# EAGLE schematic numishnik (EAGLE 6.1)
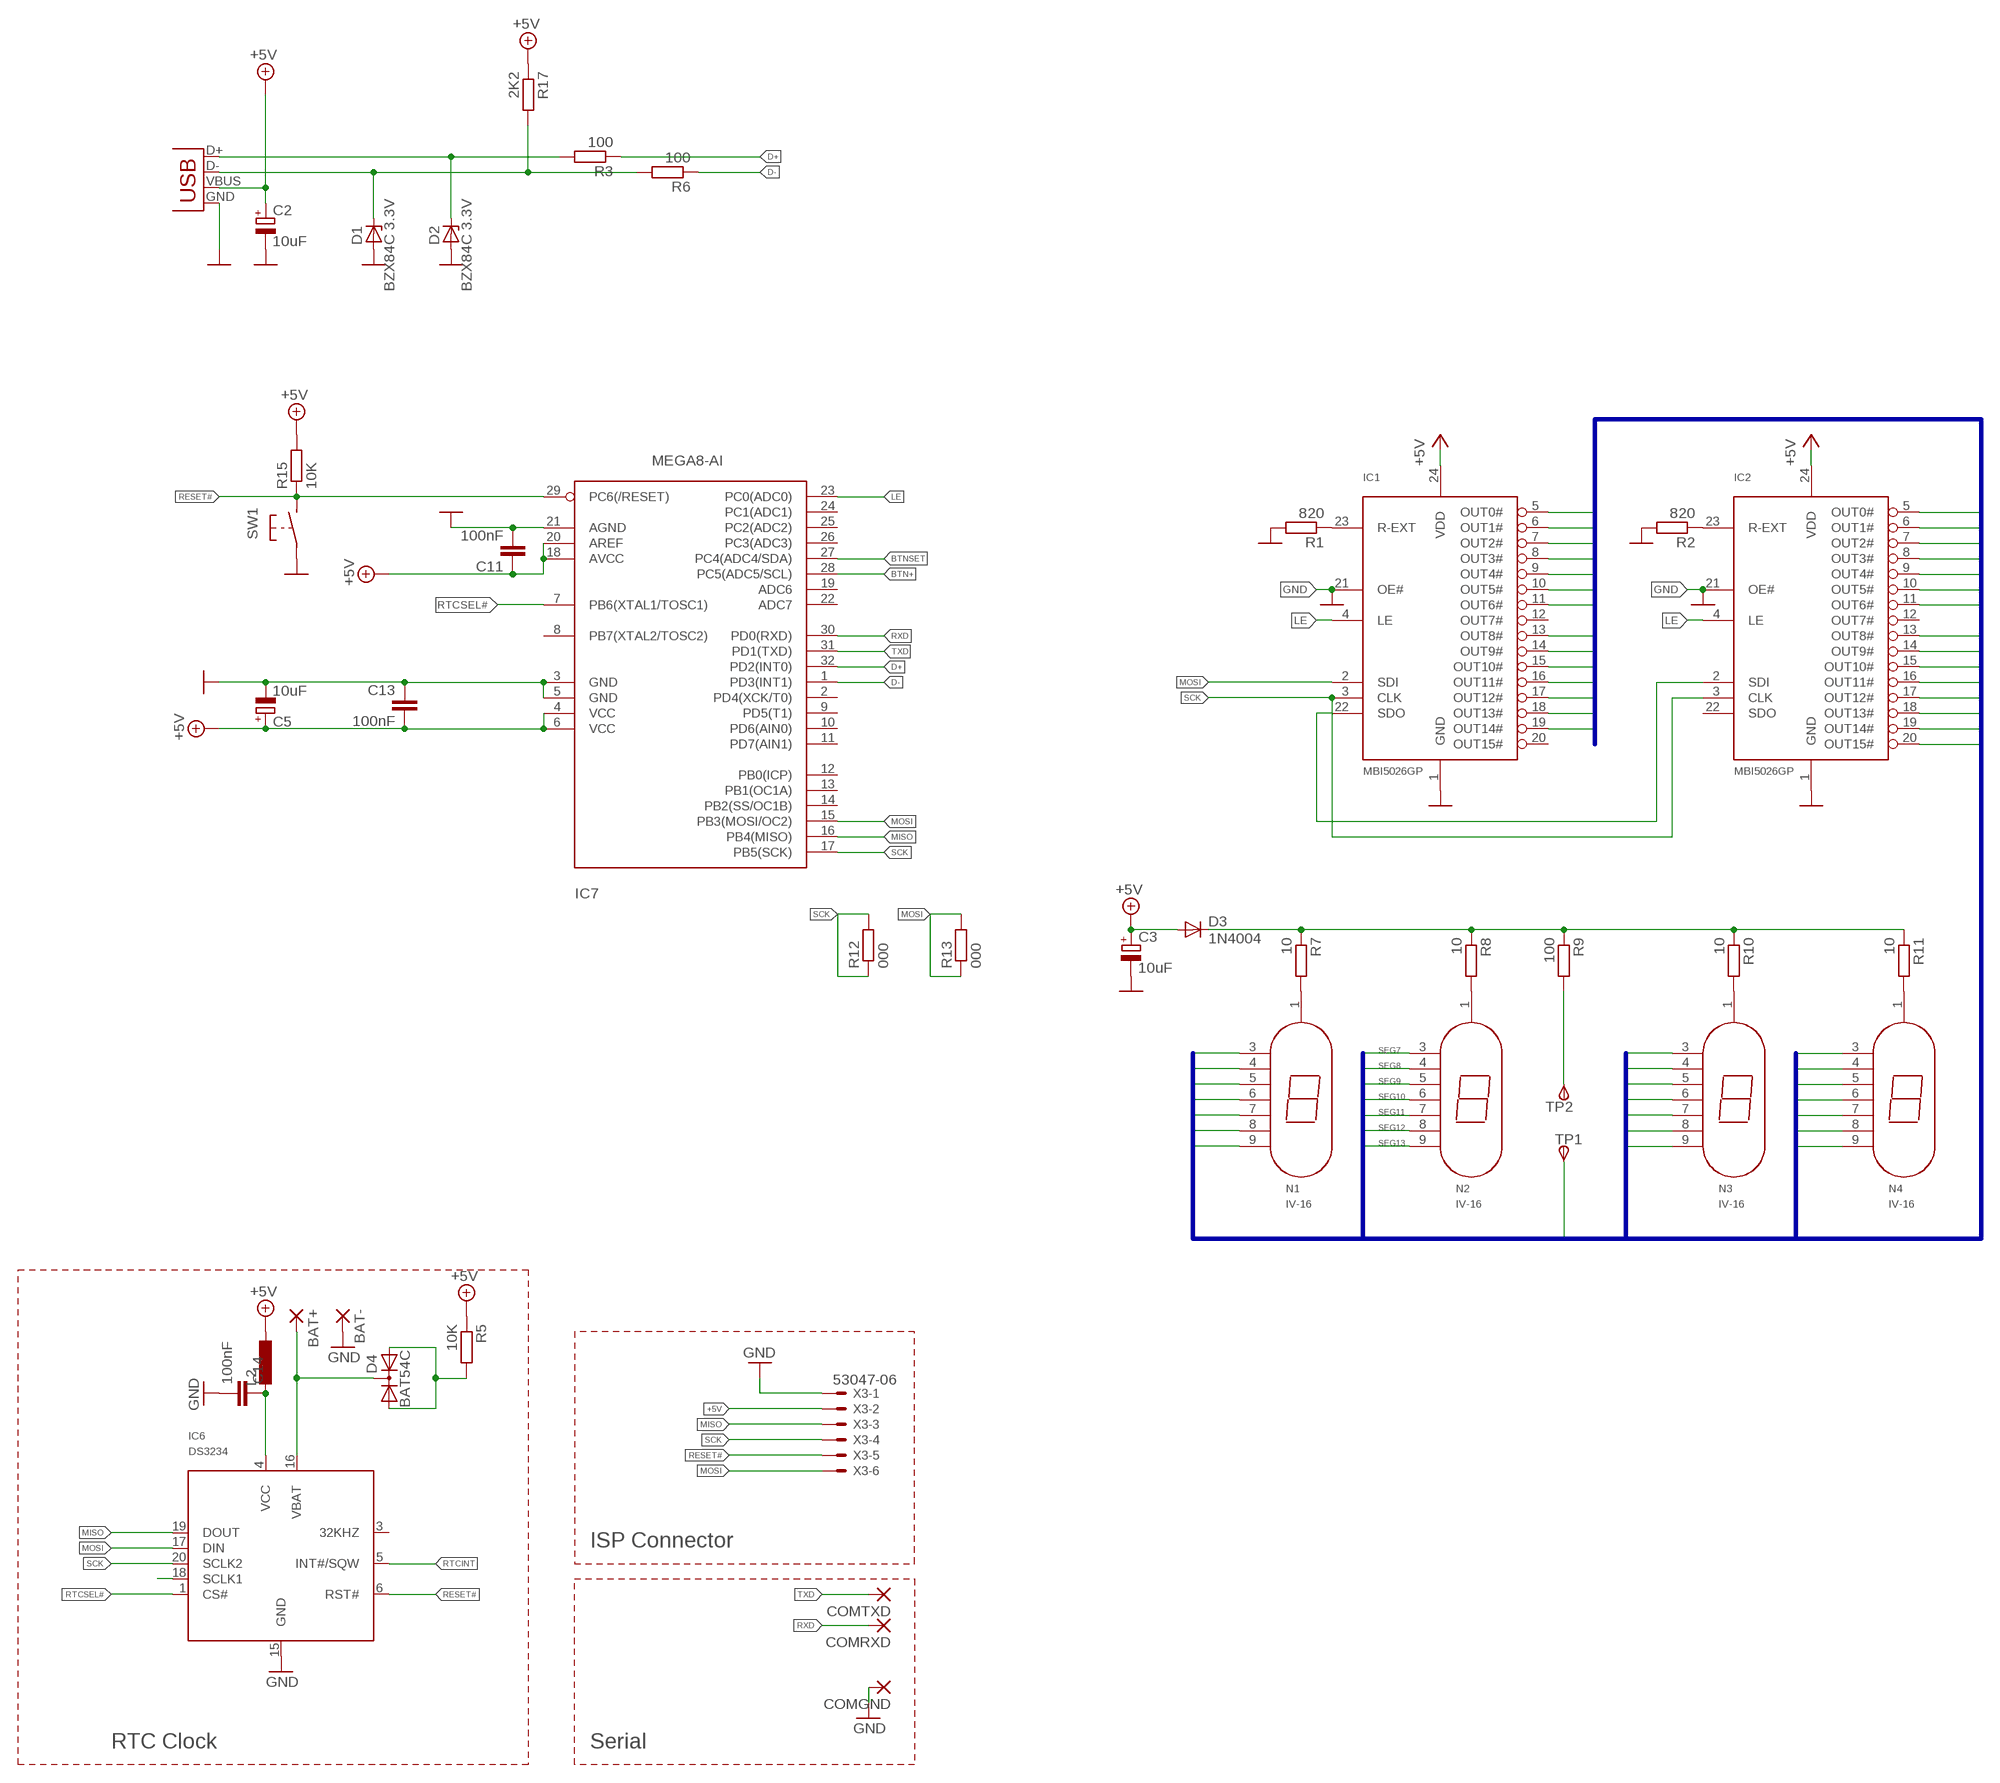
[diagram p0: schematic, sheet 1]

## Parts
BAT+  1,6/0,8  [1,6/0,8]
BAT-  1,6/0,8  [1,6/0,8]
C2  10uF  CPOL-EUSMCB  [SMC_B]
C3  10uF  CPOL-EUSMCB  [SMC_B]
C5  10uF  CPOL-EUSMCB  [SMC_B]
C11  100nF  C-EUC0603K  [C0603K]
C13  100nF  C-EUC0603K  [C0603K]
C14  100nF  C-EUC0603K  [C0603K]
COMGND  1,6/0,8  [1,6/0,8]
COMRXD  1,6/0,8  [1,6/0,8]
COMTXD  1,6/0,8  [1,6/0,8]
D1  BZX84C 3.3V  BZX84CSMD  [TO236]
D2  BZX84C 3.3V  BZX84CSMD  [TO236]
D3  1N4004  [DO41-10]
D4  BAT54C  DIODE-2AC|CASOT23  [SOT23]
IC1  MBI5026GP  [SSOP24-150]
IC2  MBI5026GP  [SSOP24-150]
IC6  DS3234  [SO-20DW]
IC7  MEGA8-AI  [TQFP32-08]
L2  L-EUL3230M  [L3230M]
N1  IV-16  [IV-16]
N2  IV-16  [IV-16]
N3  IV-16  [IV-16]
N4  IV-16  [IV-16]
R1  820  R-EU_R0805S  [R0805-SVO]
R2  820  R-EU_R0805S  [R0805-SVO]
R3  100  R-EU_R0805S  [R0805-SVO]
R5  10K  R-EU_R0805S  [R0805-SVO]
R6  100  R-EU_R0805S  [R0805-SVO]
R7  10  R-EU_R0805S  [R0805-SVO]
R8  10  R-EU_R0805S  [R0805-SVO]
R9  100  R-EU_R0805S  [R0805-SVO]
R10  10  R-EU_R0805S  [R0805-SVO]
R11  10  R-EU_R0805S  [R0805-SVO]
R12  000  R-EU_R0805S  [R0805-SVO]
R13  000  R-EU_R0805S  [R0805-SVO]
R15  10K  R-EU_R0805S  [R0805-SVO]
R17  2K2  R-EU_R0805S  [R0805-SVO]
SW1  BUTTON-IT_1181  [SW_IT1181]
TP1  TPSPAD1-13  [P1-13]
TP2  TPSPAD1-13  [P1-13]
X1  USB-MICROB  [USB-MICROB]
X3  53047-06  [53047-06]

## Nets
+5V: C2.+ C3.+ C5.+ C11.1 C13.2 D3.A IC1.24(VDD) IC2.24(VDD) IC7.4(VCC) IC7.6(VCC) IC7.18(AVCC) IC7.20(AREF) L2.1 R5.1 R15.2 R17.1 X1.VBUS X3.2
BTN+: IC7.28(PC5(ADC5/SCL))
BTNSET: IC7.27(PC4(ADC4/SDA))
D+: IC7.32(PD2(INT0)) R3.1
D-: IC7.1(PD3(INT1)) R6.1
DOT: IC2.20(OUT15#) TP1.1(PP)
GND: BAT-.1(P) C2.- C3.- C5.- C11.2 C13.1 C14.2 COMGND.1(P) D1.A D2.A IC1.1(GND) IC1.21(OE#) IC2.1(GND) IC2.21(OE#) IC6.15(GND) IC7.3(GND) IC7.5(GND) IC7.21(AGND) R1.2 R2.2 SW1.P$1(P1) X1.GND X3.1
LE: IC1.4(LE) IC2.4(LE) IC7.23(PC0(ADC0))
MISO: IC6.19(DOUT) IC7.16(PB4(MISO)) X3.3
MOSI: IC1.2(SDI) IC6.17(DIN) IC7.15(PB3(MOSI/OC2)) R13.1 R13.2 X3.6
MOSI#2: IC1.22(SDO) IC2.2(SDI)
N$2: R9.2 TP2.1(PP)
N$3: N1.1 R7.2
N$4: IC1.23(R-EXT) R1.1
N$5: IC2.23(R-EXT) R2.1
N$6: IC6.18(SCLK1)
N$7: D1.C R6.2 R17.2 X1.D-
N$8: D2.C R3.2 X1.D+
N$9: BAT+.1(P) D4.3(C) IC6.16(VBAT)
N$10: D4.1(A1) D4.2(A2) R5.2
N$11: N2.1 R8.2
N$12: N3.1 R10.2
N$13: N4.1 R11.2
N$14: D3.C R7.1 R8.1 R9.1 R10.1 R11.1
RESET#: IC6.6(RST#) IC7.29(PC6(/RESET)) R15.1 SW1.P$2(P2) X3.5
RTCINT: IC6.5(INT#/SQW)
RTCSEL#: IC6.1(CS#) IC7.7(PB6(XTAL1/TOSC1))
RTCVCC: C14.1 IC6.4(VCC) L2.2
RXD: COMRXD.1(P) IC7.30(PD0(RXD))
SCK: IC1.3(CLK) IC2.3(CLK) IC6.20(SCLK2) IC7.17(PB5(SCK)) R12.1 R12.2 X3.4
SEG0: IC1.11(OUT6#) N1.3
SEG1: IC1.10(OUT5#) N1.4
SEG2: IC1.9(OUT4#) N1.5
SEG3: IC1.8(OUT3#) N1.6
SEG4: IC1.7(OUT2#) N1.7
SEG5: IC1.6(OUT1#) N1.8
SEG6: IC1.5(OUT0#) N1.9
SEG7: IC1.19(OUT14#) N2.3
SEG8: IC1.18(OUT13#) N2.4
SEG9: IC1.17(OUT12#) N2.5
SEG10: IC1.16(OUT11#) N2.6
SEG11: IC1.15(OUT10#) N2.7
SEG12: IC1.14(OUT9#) N2.8
SEG13: IC1.13(OUT8#) N2.9
SEG14: IC2.11(OUT6#) N3.3
SEG15: IC2.10(OUT5#) N3.4
SEG16: IC2.9(OUT4#) N3.5
SEG17: IC2.8(OUT3#) N3.6
SEG18: IC2.7(OUT2#) N3.7
SEG19: IC2.6(OUT1#) N3.8
SEG20: IC2.5(OUT0#) N3.9
SEG21: IC2.19(OUT14#) N4.3
SEG22: IC2.18(OUT13#) N4.4
SEG23: IC2.17(OUT12#) N4.5
SEG24: IC2.16(OUT11#) N4.6
SEG25: IC2.15(OUT10#) N4.7
SEG26: IC2.14(OUT9#) N4.8
SEG27: IC2.13(OUT8#) N4.9
TXD: COMTXD.1(P) IC7.31(PD1(TXD))
Unconnected: IC1.12(OUT7#) IC1.20(OUT15#) IC2.12(OUT7#) IC2.22(SDO) IC6.3(32KHZ) IC7.2(PD4(XCK/T0)) IC7.8(PB7(XTAL2/TOSC2)) IC7.9(PD5(T1)) IC7.10(PD6(AIN0)) IC7.11(PD7(AIN1)) IC7.12(PB0(ICP)) IC7.13(PB1(OC1A)) IC7.14(PB2(SS/OC1B)) IC7.19(ADC6) IC7.22(ADC7) IC7.24(PC1(ADC1)) IC7.25(PC2(ADC2)) IC7.26(PC3(ADC3))

## Buses
SEG[0..27],DOT

## Notes on the sheet
- ISP Connector
- RTC Clock | Serial

## Library data of the parts
BAT+ BAT- COMGND COMRXD COMTXD = wirepad:1,6/0,8: THROUGH-HOLE PAD
C2 C3 C5 = rcl:CPOL-EU: POLARIZED CAPACITOR, European symbol
C11 C13 C14 = rcl:C-EU: CAPACITOR, European symbol
D1 D2 = diode:BZX84CSMD: Z DIODE
D3 = diode:1N4004: DIODE general purpose rectifier, 1 A
D4 = diode:DIODE-2AC|CA: Dual DIODE Anode-Cathode|Cathode-Anode
IC1 IC2 = 0-macroblock:MBI5026*
IC6 = 0-ds3234:DS3234*: Extremely Accurate SPI Bus RTC with Integrated Crystal and SRAM The DS3234 is a low-cost, extremely accurate SPI? bus real-time clock (RTC) with an integrated temperature-com- pensated crystal oscillator (TCXO) and crystal. The DS3234 incorporates a precision, temperature-compen- sated voltage reference and comparator circuit to monitor VCC. When VCCdrops below the power-fail voltage (VPF), the device asserts the RSToutput and also disables read and write access to the part when VCCdrops below both VPFand VBAT. The RSTpin is monitored as a pushbutton input for generating a µP reset. The device switches to the backup supply input and maintains accurate timekeeping when main power to the device is interrupted. The integra- tion of the crystal resonator enhances the long-term accu- racy of the device as well as reduces the piece-part count in a manufacturing line. The DS3234 is available in com- mercial and industrial temperature ranges, and is offered in an industry-standard 300-mil, 20-pin SO package. The DS3234 also integrates 256 bytes of battery-backed SRAM. In the event of main power loss, the contents of the memory are maintained by the power source con- nected to the VBATpin. The RTC maintains seconds, minutes, hours, day, date, month, and year information. The date at the end of the month is automatically adjust- ed for months with fewer than 31 days, including correc- tions for leap year. The clock operates in either the 24-hour or 12-hour format with AM/PM indicator. Two programmable time-of-day alarms and a programmable square-wave output are provided. Address and data are transferred serially by an SPI bidirectional bus. Accuracy ±2ppm from 0°C to +40°C Accuracy ±3.5ppm from -40°C to +85°C Battery Backup Input for Continuous Timekeeping Operating Temperature Ranges Commercial: 0°C to +70°C Industrial: -40°C to +85°C Low-Power Consumption Real-Time Clock Counts Seconds, Minutes, Hours, Day, Date, Month, and Year with Leap Year Compensation Valid Up to 2099 Two Time-of-Day Alarms Programmable Square-Wave Output 4MHz SPI Bus Supports Modes 1 and 3 Digital Temp Sensor Output: ±3°C Accuracy Register for Aging Trim RSTInput/Output 300-Mil, 20-Pin SO Package Underwriters Laboratories (UL®) Recognized
IC7 = atmel:MEGA8: MICROCONTROLLER 8 Kbytes FLASH, 1 kbytes SRAM, 512 bytes EEPROM, USART, 6-channel 10 bit ADC, 2-channel 8 bit ADC Pin compatible with Atmega48, ATMega88, ATMega168 Source: avr.lbr
L2 = rcl:L-EU: INDUCTOR, European symbol
N1-N4 = 0-nixies-russian:IV-16: Цифра Выводы 0 3,4,5,6,8,9 1 3,4 2 3,5,7,8,9 3 3,4,5,7,8 4 3,4,6,7 5 4,5,6,7,8 6 4,5,6,7,8,9 7 3,4,5 8 3,4,5,6,7,8,9 9 3,4,5,6,7,8
R1-R3 R5-R13 R15 R17 = rcl:R-EU_: RESISTOR, European symbol
SW1 = 0-svo:BUTTON-IT_1181
TP1 TP2 = 0-svo:TPS: TEST PIN
X1 = SparkFun:USB: USB Connectors USB-B-PTH is fully proven SKU : PRT-00139 USB-miniB is fully proven SKU : PRT-00587 USB-A-PCB is untested. USB-A-H is throughly reviewed, but untested. Spark Fun Electronics SKU : PRT-00437 USB-B-SMT is throughly reviewed, but untested. Needs silkscreen touching up. USB-A-S has not been used/tested USB-MB-H has not been used/tested
X3 = con-molex:53?-06: CONNECTOR wire to board 1.25 mm (.049 inch) pitch header